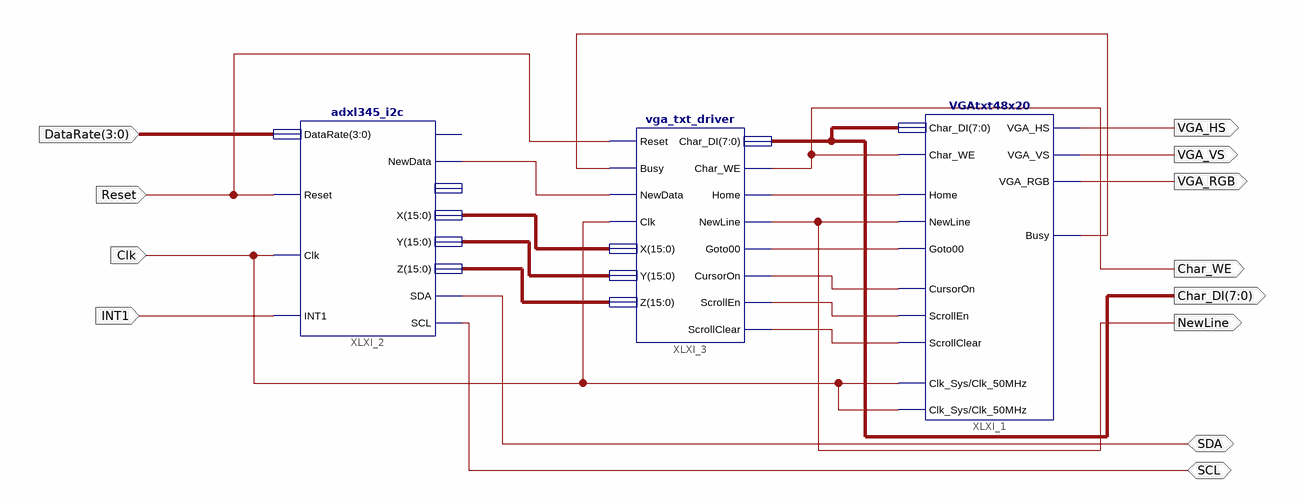
[diagram p0: schematic sheet 1]
// Xilinx ISE schematic adxl345_vga.sch (spartan3e) as structural Verilog: 3 symbols, 12 ports
module adxl345_vga (
  input  Reset,
  input  [3:0] DataRate,
  input  INT1,
  input  Clk,
  inout  SDA,
  inout  SCL,
  output [7:0] Char_DI,
  output Char_WE,
  output NewLine,
  output VGA_HS,
  output VGA_VS,
  output VGA_RGB
);

  wire XLXN_3, XLXN_11, XLXN_13, XLXN_14, XLXN_15, XLXN_16, XLXN_22;
  wire [15:0] XLXN_4, XLXN_5, XLXN_6;

  VGAtxt48x20 XLXI_1 (
    .Char_DI(Char_DI), .Home(XLXN_11), .NewLine(NewLine), .Goto00(XLXN_13), .Clk_Sys(Clk), .Clk_50MHz(Clk),
    .CursorOn(XLXN_14), .ScrollEn(XLXN_15), .ScrollClear(XLXN_16), .Busy(XLXN_22), .VGA_HS(VGA_HS),
    .VGA_VS(VGA_VS), .VGA_RGB(VGA_RGB), .Char_WE(Char_WE));
  adxl345_i2c XLXI_2 (
    .DataRate(DataRate), .Reset(Reset), .Clk(Clk), .INT1(INT1), .NewData(XLXN_3), .X(XLXN_4), .Y(XLXN_5),
    .Z(XLXN_6), .SDA(SDA), .SCL(SCL));  // open: NACK, Device_ID
  vga_txt_driver XLXI_3 (
    .Reset(Reset), .Busy(XLXN_22), .X(XLXN_4), .Y(XLXN_5), .Z(XLXN_6), .NewData(XLXN_3), .Clk(Clk),
    .Char_DI(Char_DI), .Char_WE(Char_WE), .Home(XLXN_11), .NewLine(NewLine), .Goto00(XLXN_13),
    .CursorOn(XLXN_14), .ScrollEn(XLXN_15), .ScrollClear(XLXN_16));
endmodule
